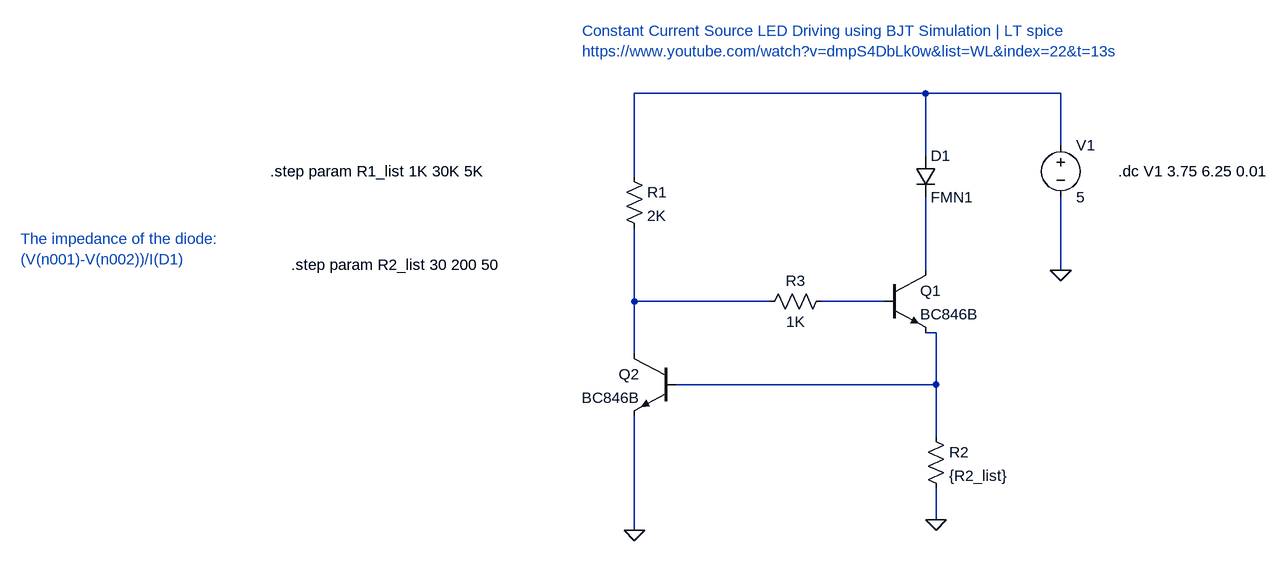
[diagram p0: schematic constant_current_src_led_driving.asc]
constant_current_src_led_driving.asc, the LTspice schematic file:
Version 4
SHEET 1 880 680
WIRE 256 -144 -192 -144
WIRE 464 -144 256 -144
WIRE 464 -64 464 -144
WIRE 256 -48 256 -144
WIRE -192 -16 -192 -144
WIRE 256 128 256 16
WIRE 464 128 464 16
WIRE -192 176 -192 64
WIRE 16 176 -192 176
WIRE 192 176 96 176
WIRE 272 224 256 224
WIRE -192 256 -192 176
WIRE 272 304 272 224
WIRE 272 304 -128 304
WIRE 272 384 272 304
WIRE 272 512 272 464
WIRE -192 528 -192 352
FLAG 272 512 0
FLAG -192 528 0
FLAG 464 128 0
SYMBOL npn 192 128 R0
SYMATTR InstName Q1
SYMATTR Value BC846B
SYMBOL res -208 -32 R0
SYMATTR InstName R1
SYMATTR Value 2K
SYMBOL res 256 368 R0
SYMATTR InstName R2
SYMATTR Value {R2_list}
SYMBOL res 112 160 R90
WINDOW 0 0 56 VBottom 2
WINDOW 3 32 56 VTop 2
SYMATTR InstName R3
SYMATTR Value 1K
SYMBOL npn -128 256 M0
SYMATTR InstName Q2
SYMATTR Value BC846B
SYMBOL diode 240 -48 R0
SYMATTR InstName D1
SYMATTR Value FMN1
SYMBOL voltage 464 -80 R0
WINDOW 123 0 0 Left 0
WINDOW 39 0 0 Left 0
SYMATTR InstName V1
SYMATTR Value 5
TEXT 552 -24 Left 2 !.dc V1 3.75 6.25 0.01
TEXT -272 -240 Left 2 ;Constant Current Source LED Driving using BJT Simulation | LT spice\nhttps://www.youtube.com/watch?v=dmpS4DbLk0w&list=WL&index=22&t=13s
TEXT -752 -24 Left 2 !.step param R1_list 1K 30K 5K
TEXT -720 120 Left 2 !.step param R2_list 30 200 50
TEXT -1136 80 Left 2 ;The impedance of the diode:\n(V(n001)-V(n002))/I(D1)

The netlist it stands for:
* constant_current_src_led_driving.asc
Q1 N002 N004 N005 0 BC846B
R1 N001 N003 2K
R2 N005 0 {R2_list}
R3 N004 N003 1K
Q2 N003 N005 0 0 BC846B
D1 N001 N002 FMN1
V1 N001 0 5
.model D D
.lib standard.dio
.model NPN NPN
.model PNP PNP
.lib standard.bjt
.dc V1 3.75 6.25 0.01
* Constant Current Source LED Driving using BJT Simulation | LT spice
* https://www.youtube.com/watch?v=dmpS4DbLk0w&list=WL&index=22&t=13s
.step param R1_list 1K 30K 5K
.step param R2_list 30 200 50
* The impedance of the diode:
* (V(n001)-V(n002))/I(D1)
.backanno
.end